# EAGLE design Cap1 (EAGLE 7.7.0)
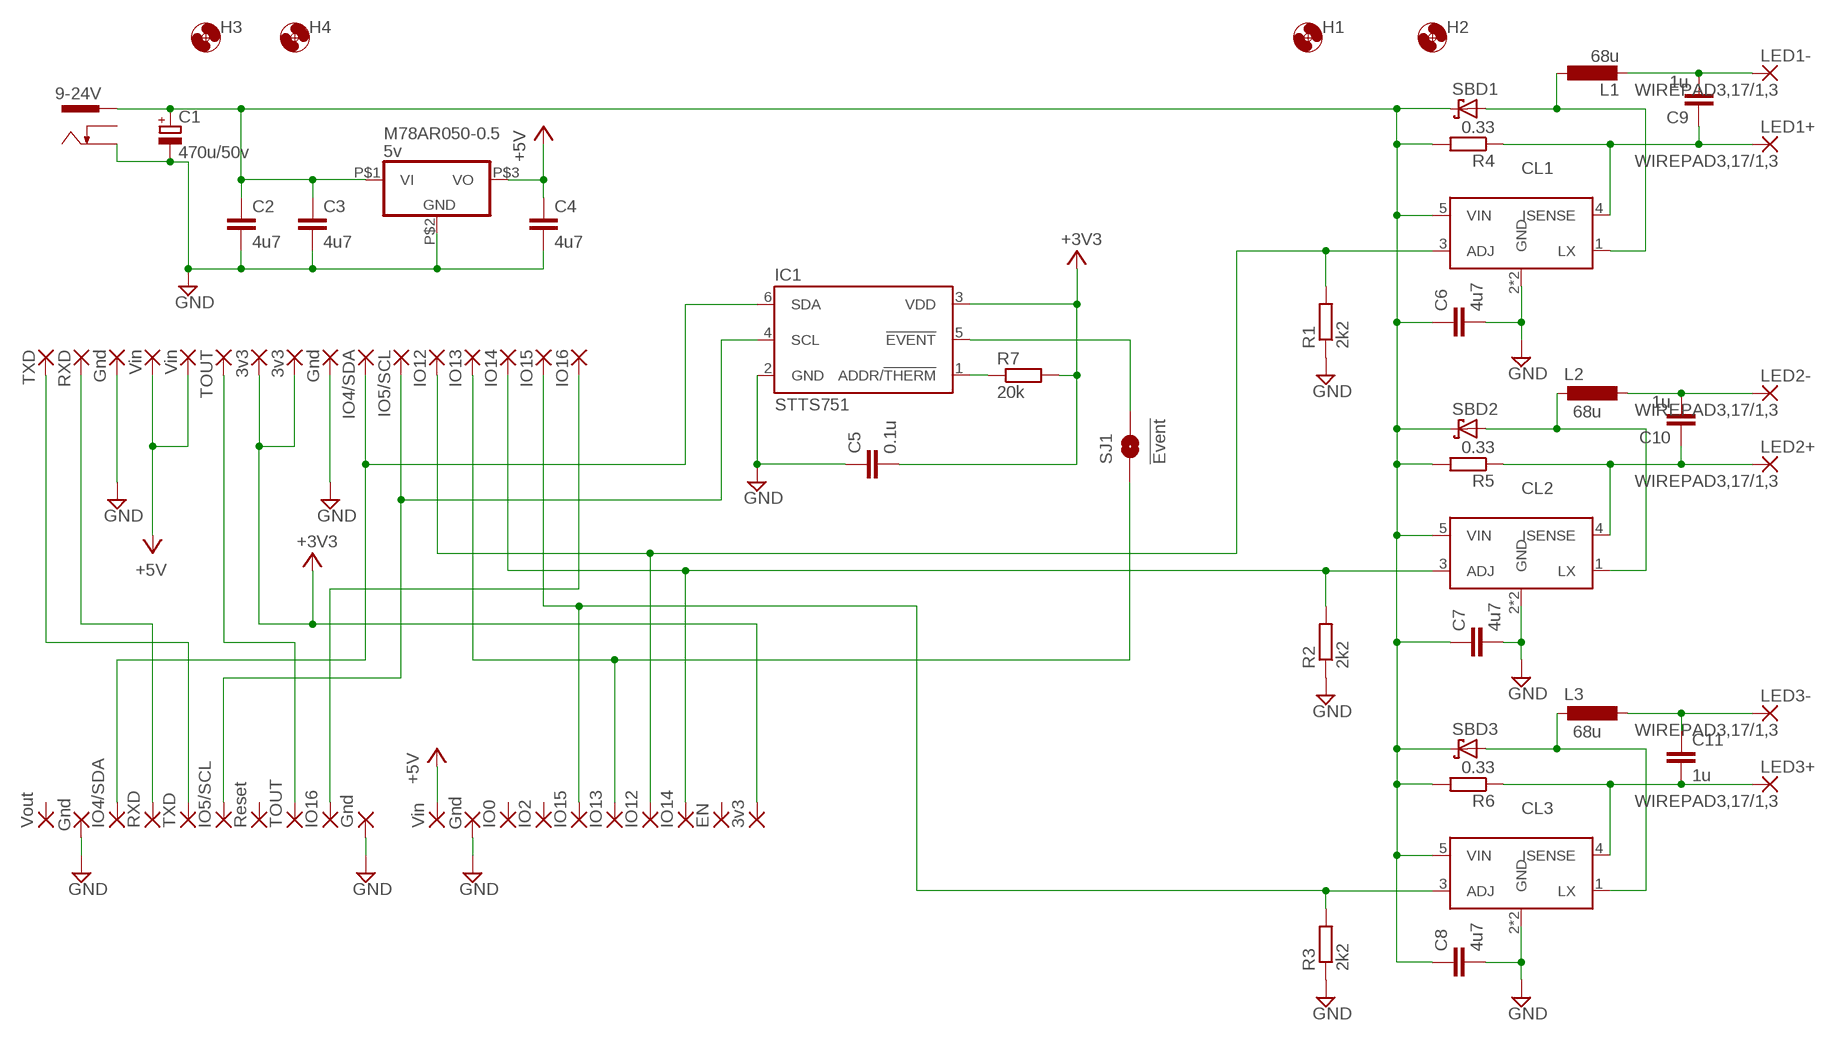
[diagram p0: schematic, sheet 1]

## Parts
0  IO0  1,6/0,8  [1,6/0,8]
2  IO2  1,6/0,8  [1,6/0,8]
3V  3v3  1,6/0,8  [1,6/0,8]
3V3  3v3  1,6/0,8  [1,6/0,8]
3V3'  3v3  1,6/0,8  [1,6/0,8]
4  IO4/SDA  1,6/0,8  [1,6/0,8]
5  IO5/SCL  1,6/0,8  [1,6/0,8]
9-24V  DCJACK-MJ179P-R  [MJ-179P-R]
12  IO12  1,6/0,8  [1,6/0,8]
13  IO13  1,6/0,8  [1,6/0,8]
14  IO14  1,6/0,8  [1,6/0,8]
15  IO15  1,6/0,8  [1,6/0,8]
16  IO16  1,6/0,8  [1,6/0,8]
C1  470u/50v  CPOL-EUE5-13  [E5-13]
C2  4u7  C-EUC0805  [C0805]
C3  4u7  C-EUC0805  [C0805]
C4  4u7  C-EUC0805  [C0805]
C5  0.1u  C-EUC0603  [C0603]
C6  4u7  C-EUC0805  [C0805]
C7  4u7  C-EUC0805  [C0805]
C8  4u7  C-EUC0805  [C0805]
C9  1u  C-EUC0603  [C0603]
C10  1u  C-EUC0603  [C0603]
C11  1u  C-EUC0603  [C0603]
CL1  CL6807  [SOT89-5]
CL2  CL6807  [SOT89-5]
CL3  CL6807  [SOT89-5]
EN  EN  1,6/0,8  [1,6/0,8]
G  Gnd  1,6/0,8  [1,6/0,8]
G'  Gnd  1,6/0,8  [1,6/0,8]
G''  Gnd  1,6/0,8  [1,6/0,8]
GND  Gnd  1,6/0,8  [1,6/0,8]
GND1  Gnd  1,6/0,8  [1,6/0,8]
H1  MOUNT-HOLE3.0  [3,0]
H2  MOUNT-HOLE3.0  [3,0]
H3  MOUNT-HOLE3.0  [3,0]
H4  MOUNT-HOLE3.0  [3,0]
IC1  STTS751  STTS751-SOT-23-6  [SOT23-6]
IO4/SDA  IO4/SDA  1,6/0,8  [1,6/0,8]
IO5/SCL  IO5/SCL  1,6/0,8  [1,6/0,8]
IO12-CH1  IO12  1,6/0,8  [1,6/0,8]
IO13'  IO13  1,6/0,8  [1,6/0,8]
IO14-CH2  IO14  1,6/0,8  [1,6/0,8]
IO15-CH3  IO15  1,6/0,8  [1,6/0,8]
IO16  IO16  1,6/0,8  [1,6/0,8]
L1  68u  NR10050NR10050  [NR10050]
L2  68u  NR10050NR10050  [NR10050]
L3  68u  NR10050NR10050  [NR10050]
LED1+  WIREPAD3,17/1,3  [3,17/1,3]
LED1-  WIREPAD3,17/1,3  [3,17/1,3]
LED2+  WIREPAD3,17/1,3  [3,17/1,3]
LED2-  WIREPAD3,17/1,3  [3,17/1,3]
LED3+  WIREPAD3,17/1,3  [3,17/1,3]
LED3-  WIREPAD3,17/1,3  [3,17/1,3]
M78AR050-0.5  5v  M78AR033033-0.5  [M78AR]
R1  2k2  R-EU_R0603  [R0603]
R2  2k2  R-EU_R0603  [R0603]
R3  2k2  R-EU_R0603  [R0603]
R4  0.33  R-EU_R3225  [R3225]
R5  0.33  R-EU_R3225  [R3225]
R6  0.33  R-EU_R3225  [R3225]
R7  20k  R-EU_R0603  [R0603]
RS  Reset  1,6/0,8  [1,6/0,8]
RX  RXD  1,6/0,8  [1,6/0,8]
RXD  RXD  1,6/0,8  [1,6/0,8]
SBD1  SS2040FL2SS2040FL  [SOD-123FL]
SBD2  SS2040FL2SS2040FL  [SOD-123FL]
SBD3  SS2040FL2SS2040FL  [SOD-123FL]
SJ1  !Event  SOLDERJUMPERNO  [SJ_2S-NO]
TO  TOUT  1,6/0,8  [1,6/0,8]
TOUT  TOUT  1,6/0,8  [1,6/0,8]
TX  TXD  1,6/0,8  [1,6/0,8]
TXD  TXD  1,6/0,8  [1,6/0,8]
VI  Vin  1,6/0,8  [1,6/0,8]
VIN  Vin  1,6/0,8  [1,6/0,8]
VIN'  Vin  1,6/0,8  [1,6/0,8]
VO  Vout  1,6/0,8  [1,6/0,8]

## Nets
24VSUPPLY [Power]: 9-24V.1 C1.+ C2.1 C3.1 C6.1 C7.1 C8.1 CL1.5(VIN) CL2.5(VIN) CL3.5(VIN) M78AR050-0.5.P$1(VI) R4.2 R5.2 R6.2 SBD1.C SBD2.C SBD3.C
+3V3 [Power3v3]: 3V3'.1(P) 3V3.1(P) 3V.1(P) C5.2 IC1.3(VDD) R7.2
+5V [Power5v]: C4.1 M78AR050-0.5.P$3(VO) VI.1(P) VIN'.1(P) VIN.1(P)
GND [GND]: 9-24V.2 C1.- C2.2 C3.2 C4.2 C5.1 C6.2 C7.2 C8.2 CL1.2(GND) CL1.2@TAB(GND) CL2.2(GND) CL2.2@TAB(GND) CL3.2(GND) CL3.2@TAB(GND) G''.1(P) G'.1(P) G.1(P) GND1.1(P) GND.1(P) IC1.2(GND) M78AR050-0.5.P$2(GND) R1.1 R2.1 R3.1
N$1: RX.1(P) RXD.1(P)
N$2: TX.1(P) TXD.1(P)
N$3: TO.1(P) TOUT.1(P)
N$4: 15.1(P) CL3.3(ADJ) IO15-CH3.1(P) R3.2
N$5: IC1.1(ADDR/!THERM) R7.1
N$6: 13.1(P) IO13'.1(P) SJ1.1
N$7: 4.1(P) IC1.6(SDA) IO4/SDA.1(P)
N$8: 5.1(P) IC1.4(SCL) IO5/SCL.1(P)
N$9: IC1.5(!EVENT) SJ1.2
N$10: 12.1(P) CL1.3(ADJ) IO12-CH1.1(P) R1.2
N$11: 14.1(P) CL2.3(ADJ) IO14-CH2.1(P) R2.2
N$12 [LEDOUT]: C11.1 L3.P$2 LED3-.1(P)
N$13 [LEDOUT]: C9.1 CL1.4(ISENSE) LED1+.1(P) R4.1
N$16 [LEDOUT]: CL1.1(LX) L1.P$1 SBD1.A
N$17 [LEDOUT]: C10.2 L2.P$2 LED2-.1(P)
N$34 [LEDOUT]: CL3.1(LX) L3.P$1 SBD3.A
N$35 [LEDOUT]: CL2.1(LX) L2.P$1 SBD2.A
N$44 [LEDOUT]: C10.1 CL2.4(ISENSE) LED2+.1(P) R5.1
N$45 [LEDOUT]: C9.2 L1.P$2 LED1-.1(P)
N$46: 16.1(P) IO16.1(P)
N$47 [LEDOUT]: C11.2 CL3.4(ISENSE) LED3+.1(P) R6.1
Unconnected: 0.1(P) 2.1(P) 9-24V.3 EN.1(P) RS.1(P) VO.1(P)

## Library data of the parts
0 2 3V 3V3 3V3' 4 5 12-16 EN G G' G'' GND GND1 IO4/SDA IO5/SCL IO12-CH1 IO13' IO14-CH2 IO15-CH3 IO16 RS RX RXD TO TOUT TX TXD VI VIN VIN' VO = wirepad:1,6/0,8: THROUGH-HOLE PAD
9-24V = kamiki-dcjack:DCJACK: DC JACK 2.1mmφ - 5.5mmφ DCジャック、基板用。
C1 = resistor:CPOL-EU: POLARIZED CAPACITOR, European symbol
C2-C11 = resistor:C-EU: CAPACITOR, European symbol
CL1-CL3 = akizuki:CL6807
H1-H4 = holes:MOUNT-HOLE: MOUNTING HOLE with drill center marker
IC1 = stts751:STTS751-SOT-23-6: STTS751
L1-L3 = NR100500:NR10050
LED1+ LED1- LED2+ LED2- LED3+ LED3- = wirepad:WIREPAD: Wire PAD connect wire on PCB
M78AR050-0.5 = akizuki:M78AR033: The MINMAX M78A series is a new range of switching regulators designed as a drop-in replacement for old LM78xx linear regulators with low efficiency.
R1-R7 = resistor:R-EU_: RESISTOR, European symbol
SBD1-SBD3 = akizuki:SS2040FL: SS2040FL 2A/40V ULTRA-LOW VF SURFACE MOUNT SCHOTTKY DIODE These ultra-efficient, low VF Schottky diodes feature high current capability, while housed in a very small SOD-123 Flat Lead package. They are ideal for applications requiring maximum power dissipation per board area.
SJ1 = SparkFun:SOLDERJUMPER: Solder Jumper Standard SMD solder jumper. Used to automate production. Two varients : Normally Open and Normally Closed are the same, but have different paste layers. NC will have a large amount of paste and should jumper during reflow.

## Net classes
1 Power: width 1.016 mm
3 Power5v: width 0.61 mm
4 Power3v3: width 0.305 mm
5 LEDOUT: width 0.61 mm, clearance 0.305 mm
6 GND: width 1.016 mm
7 newNet: width 0.61 mm

## Board
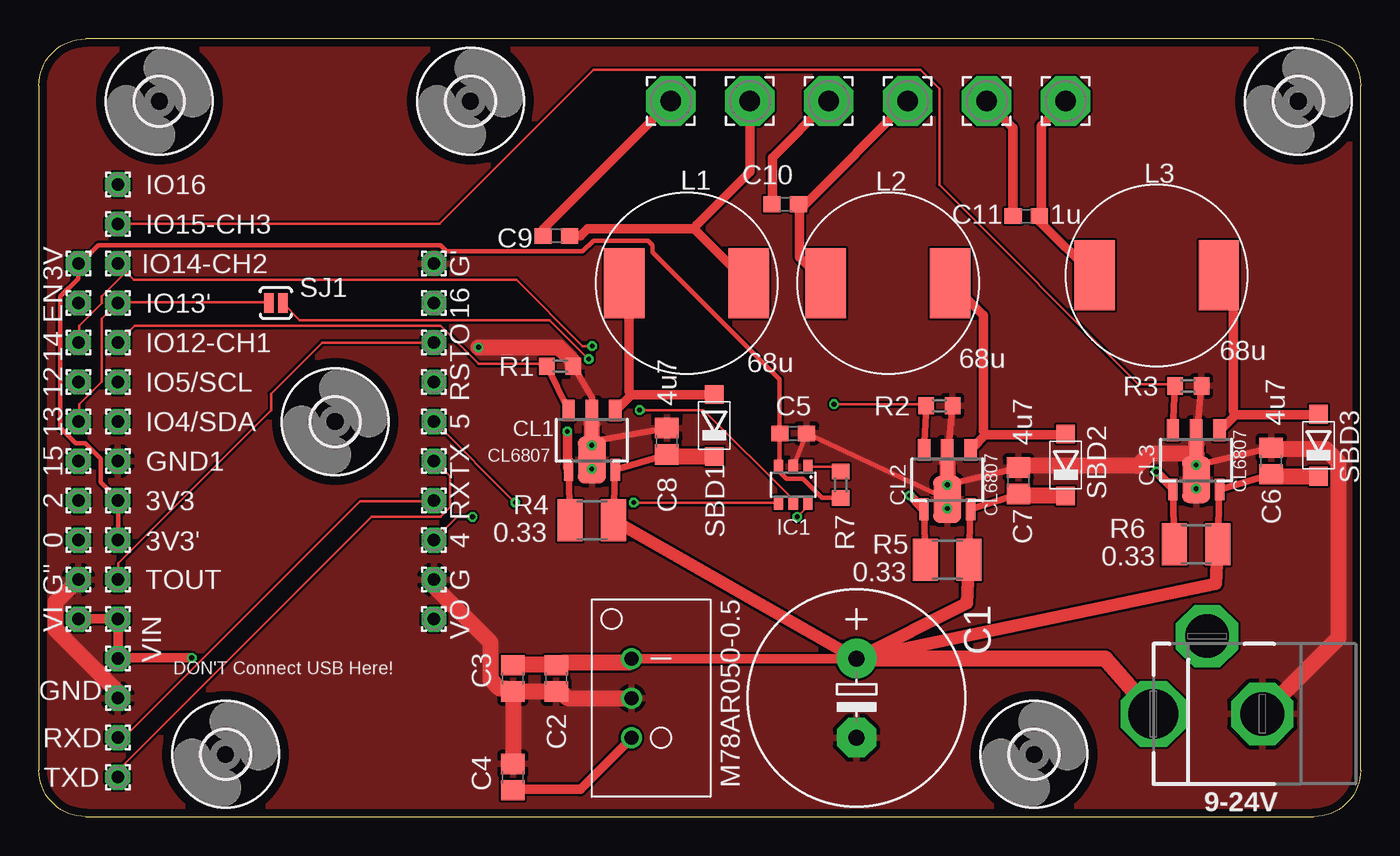
[diagram p1: board, top side]
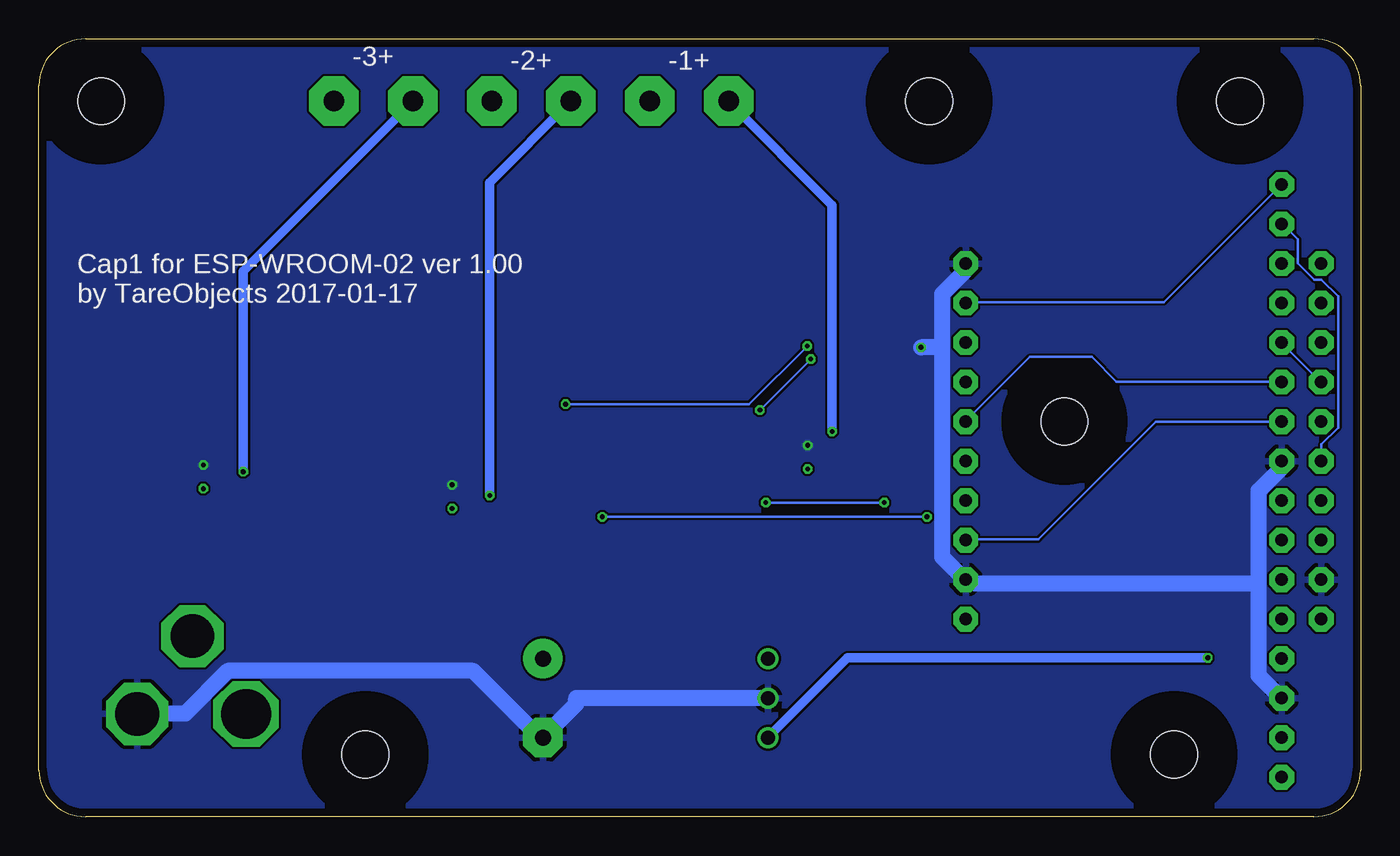
[diagram p2: board, bottom side, seen from below]

Size 85 x 50 mm. Coordinates in mm from the lower left corner, seen from the top.
Outline: 3,0 82,0 arc90 85,3 85,47 arc90 82,50 3,50 arc90 0,47 0,3 arc90 3,0
Copper layers (1*16): Top 0.035mm / dielectric 1.6mm / Bottom 0.035mm
Design rules "Elecrow_2-layer_PCB_eagle_rule": minimum track width 6mil, minimum drill 12mil, track to track 6mil, track to pad 6mil, pad to pad 6mil, via to via 8mil, smd to smd 0mil, copper to edge 20mil, drill to drill 10mil, minimum pad ring 6mil, minimum via ring 6mil, stop-mask expansion 0mil, vias tented up to drill 100mil, thermal gap 10mil

### Footprints (pad centres in the part's own frame; a part is rotated, then mirrored left to right if it is on the bottom)
1,6/0,8 = drill 0.813 pad 1.6 octagon: 1 0,0
MJ-179P-R = drill 3.2 pad 4 octagon: 1 3,0 | drill 2.8 pad 4 octagon: 2 -4,0; 3 -0.45,-5
E5-13 = drill 1.016 pad 2.54: + -2.54,0 | drill 1.016 pad 2.54 octagon: - 2.54,0
C0805 = smd 1.3 x 1.5: 1 -0.85,0; 2 0.85,0
C0603 = smd 1.1 x 1: 1 -0.85,0; 2 0.85,0
SOT89-5 = smd 0.8 x 1.4: 1 -1.499,-1.981; 3 1.499,-1.981 | smd 0.8 x 2.9: 2 0,-1.227 | smd 1.8 x 3: 2@TAB 0,1.2 | smd 0.6 x 1.4: 4 1.499,1.829; 5 -1.499,1.829
3,0 = hole 3: 0,0
SOT23-6 = smd 0.6 x 0.9: 1 -0.95,-1.15; 2 0,-1.15; 3 0.95,-1.15; 4 0.95,1.15; 5 0,1.15; 6 -0.95,1.15
NR10050 = smd 2.6 x 4.5: P$1 -4,0; P$2 4,0
3,17/1,3 = drill 1.321 pad 3.175 octagon: 1 0,0
M78AR = drill 0.9: P$1 -2.54,0; P$2 0,0; P$3 2.54,0
R0603 = smd 1 x 1.1: 1 -0.85,0; 2 0.85,0
R3225 = smd 1.6 x 2.7: 1 -1.4,0; 2 1.4,0
SOD-123FL = smd 1.194 x 1.194: A 1.994,0; C -1.994,0
SJ_2S-NO = smd 0.635 x 1.27: 1 -0.45,0; 2 0.45,0

### Placement (x,y rotation side)
0  2.54,17.78 90 top
2  2.54,20.32 90 top
3V  2.54,35.56 90 top
3V3  5.08,20.32 90 top
3V3'  5.08,17.78 90 top
4  25.4,17.78 90 top
5  25.4,25.4 90 top
9-24V  74.68,6.6 180 top
12  2.54,27.94 90 top
13  2.54,25.4 90 top
14  2.54,30.48 90 top
15  2.54,22.86 90 top
16  25.4,33.02 90 top
C1  52.58,7.62 270 top
C2  33.27,8.89 270 top
C3  30.48,8.89 270 top
C4  30.48,2.54 90 top
C5  48.51,24.64 180 top
C6  79.25,22.86 90 top
C7  62.99,21.59 90 top
C8  40.39,24.13 90 top
C9  33.27,37.34 0 top
C10  48.01,39.37 0 top
C11  63.5,38.61 180 top
CL1  35.56,24.13 180 top
CL2  58.42,21.59 180 top
CL3  74.42,22.86 180 top
EN  2.54,33.02 90 top
G  25.4,15.24 90 top
G'  25.4,35.56 90 top
G''  2.54,15.24 90 top
GND  5.08,7.62 90 top
GND1  5.08,22.86 90 top
H1  7.75,46 0 top
H2  64,4 0 top
H3  27.75,46 0 top
H4  81,46 0 top
H5  MOUNT-HOLE3.0  [3,0]  19.05,25.4 0 top
H6  MOUNT-HOLE3.0  [3,0]  12,4 0 top
IC1  48.51,21.34 180 top
IO4/SDA  5.08,25.4 90 top
IO5/SCL  5.08,27.94 90 top
IO12-CH1  5.08,30.48 90 top
IO13'  5.08,33.02 90 top
IO14-CH2  5.08,35.56 90 top
IO15-CH3  5.08,38.1 90 top
IO16  5.08,40.64 90 top
L1  41.66,34.29 0 top
L2  54.61,34.29 180 top
L3  71.88,34.8 180 top
LED1+  40.64,46 0 top
LED1-  45.72,46 180 top
LED2+  50.8,46 0 top
LED2-  55.88,46 0 top
LED3+  60.96,46 0 top
LED3-  66.04,46 0 top
M78AR050-0.5  38.1,7.62 270 top
R1  33.53,28.96 180 top
R2  57.91,26.42 180 top
R3  73.91,27.69 180 top
R4  35.56,19.05 0 top
R5  58.42,16.51 0 top
R6  74.42,17.53 0 top
R7  51.56,21.34 270 top
RS  25.4,27.94 90 top
RX  25.4,20.32 90 top
RXD  5.08,5.08 90 top
SBD1  43.43,25.15 90 top
SBD2  66.04,22.61 90 top
SBD3  82.3,23.88 90 top
SJ1  15.24,33.02 0 top
TO  25.4,30.48 90 top
TOUT  5.08,15.24 90 top
TX  25.4,22.86 90 top
TXD  5.08,2.54 90 top
VI  2.54,12.7 90 top
VIN  5.08,10.16 90 top
VIN'  5.08,12.7 90 top
VO  25.4,12.7 90 top

### Tracks (layer width: path | path; a pad name or v marks a point on that pad's centre or on a via)
24VSUPPLY
  Top 0.406: R4.2 CL1.5 C8.1 | R5.2 CL2.5 C7.1 | R6.2 CL3.5 C6.1
  Top 0.61: M78AR050-0.5.P$1 C1.+
  Top 0.813: C1.+ R4.2 | C1.+ 59.69,13.72 R5.2 | R6.2 75.69,14.99 C1.+
  Top 1.016: 9-24V.1 68.58,10.16 C1.+ | C3.1 30.48,9.75 33.22,9.75 C2.1 33.76,9.91 37.95,9.91 M78AR050-0.5.P$1 | SBD2.C 65.99,20.65 63.17,20.65 C7.1 | SBD3.C 79.4,21.87 C6.1 | SBD1.C 43.43,23.16 40.54,23.16 C8.1
+3V3
  Top 0.305: C5.2 47.62,24.61 47.62,22.55 IC1.3 47.62,22.4 47.62,22.17 48.08,21.72 49.15,21.72 50.37,20.5 51.51,20.5 R7.2 | 3V3'.1 5.11,17.83 5.11,20.27 3V3.1 5.03,20.42 3.96,21.49 3.96,23.01 2.97,24 2.36,24 1.37,24.99 1.37,33.45 2.52,34.59 2.52,35.51 3V.1 2.67,35.59 3.81,36.73 25.83,36.73 26.21,36.35 34.98,36.35 35.66,37.03 39.17,37.03 39.47,36.73 39.47,36.27 47.62,28.12 47.62,24.92 C5.2 | 47.62,24.77 C5.2
+5V  (via drill 0.3)
  Top 0.61: VI.1 2.59,12.72 4.8,12.72 VIN'.1 5.11,12.65 5.11,10.21 VIN.1 5.41,10.21 v9.83,10.21 | C4.1 30.48,1.75 34.82,1.75 38.1,5.03 M78AR050-0.5.P$3
  Bottom 0.61: v9.83,10.21 32.99,10.21 38.1,5.11 M78AR050-0.5.P$3
GND  (via drill 0.3)
  Top 0.305: IC1.2 C5.1 CL2.2@TAB
  Top 0.406: CL2.2 R2.1 | CL3.2 R3.1 | C8.2 35.56,24.13 v35.56,23.88 CL1.2@TAB | C7.2 v58.42,21.34 CL2.2@TAB | R1.1 35.56,26.92 CL1.2 | C6.2 v74.42,22.61 CL3.2@TAB
  Top 1.016: 74.45,23.32 74.45,22.78 CL3.2@TAB | 74.45,23.32 74.45,23.93 CL3.2 | C6.2 79.4,23.62 82.75,23.62 83.59,22.78 83.59,11.51 78.72,6.63 9-24V.2 | GND.1 5.03,7.62 5.03,8.08 1.07,12.04 1.07,13.79 2.52,15.24 G''.1 | CL1.2 35.59,25.22 35.59,24.31 CL1.2@TAB | C3.2 C4.2 | C3.2 30.94,8.08 33.22,8.08 C2.2 33.76,7.85 33.98,7.62 M78AR050-0.5.P$2 | G.1 25.45,15.24 25.45,14.78 29.03,11.2 29.03,8.84 29.64,8.23 30.02,8.23 C3.2 | v28.27,30.18 33.45,30.18 34.29,29.34 34.29,29.11 R1.1 | CL2.2 58.45,22.63 58.45,21.49 CL2.2@TAB | 74.45,23.32 71.4,23.32 70.64,22.55 63.17,22.55 C7.2
  Bottom 1.016: 6.55,15.01 6.55,9.07 5.11,7.62 GND.1 | 6.55,15.01 6.55,20.95 5.11,22.4 5.11,22.86 GND1.1 | 26.9,30.18 26.9,16.69 25.45,15.24 G.1 24.92,15.01 6.55,15.01 | 26.9,30.18 26.9,33.6 25.45,35.05 25.45,35.51 G'.1 | 26.9,30.18 v28.27,30.18 | M78AR050-0.5.P$2 50.44,7.62 50.44,7.24 52.58,5.11 C1.- 53.03,5.33 57.07,9.37 72.85,9.37 75.59,6.63 78.64,6.63 9-24V.2
  pour Bottom: 0,0 86.36,0 86.36,50.8 0,50.8
  pour Top: 0,0 88.9,0 88.9,50.8 0,50.8
N$1
  Top 0.152: RXD.1 5.11,5.11 5.49,5.11 20.65,20.27 25.38,20.27 RX.1
N$2
  Top 0.152: TXD.1 5.11,2.59 5.11,2.97 21.41,19.28 25.83,19.28 26.44,19.89 26.44,21.87 25.45,22.86 TX.1
N$3
  Top 0.152: TO.1 18.21,30.48 14.94,27.2 14.94,26.14 5.11,16.31 5.11,15.24 TOUT.1
N$4
  Top 0.152: IO15-CH3.1 25.76,38.1 35.66,48.01 56.69,48.01 57.91,46.79 57.91,40.62 70.71,27.81 72.92,27.81 R3.2
  Top 0.406: CL3.3 R3.2
  Bottom 0.152: 15.1 2.52,22.86 2.52,23.93 1.45,24.99 1.45,33.45 2.52,34.52 2.97,34.52 4.04,35.59 4.04,37.11 5.03,38.1 IO15-CH3.1
N$5
  Top 0.152: IC1.1 49.53,22.48 51.28,22.48 51.51,22.25 R7.1
N$6
  Top 0.152: SJ1.1 14.78,33.07 5.11,33.07 IO13'.1 5.03,32.99 4.04,32 4.04,27.96 2.59,26.52 2.59,25.45 13.1
N$7  (via drill 0.3)
  Top 0.152: v48.77,19.28 49.45,19.96 49.45,20.12 IC1.6 | v27.89,19.28 26.9,19.28 4.1
  Bottom 0.152: v27.89,19.28 v48.77,19.28 | IO4/SDA.1 5.11,25.38 13.18,25.38 20.73,17.83 25.38,17.83 4.1
N$8  (via drill 0.3)
  Top 0.152: v38.25,20.19 47.55,20.19 IC1.4 | v30.63,20.19 25.45,25.38 5.1
  Bottom 0.152: v30.63,20.19 v38.25,20.19 | IO5/SCL.1 5.11,27.96 15.7,27.96 17.3,29.57 21.26,29.57 25.38,25.45 5.1
N$9  (via drill 0.3)
  Top 0.152: v38.63,26.14 42.75,26.14 48.46,20.42 48.46,20.19 IC1.5 | v35.36,29.41 32.84,31.93 16.76,31.93 15.7,32.99 SJ1.2
  Bottom 0.152: v35.36,29.41 v38.63,26.14
N$10
  Top 0.152: R1.2 32.54,29.11 28.27,29.11 25.83,31.55 6.17,31.55 5.11,30.48 IO12-CH1.1
  Top 0.406: CL1.3 R1.2
  Bottom 0.152: 12.1 2.59,27.96 5.11,30.48 IO12-CH1.1
N$11  (via drill 0.3)
  Top 0.152: v51.13,26.52 56.92,26.52 R2.2 | v35.59,30.25 34.98,30.25 30.71,34.52 6.1,34.52 5.11,35.51 IO14-CH2.1 5.56,34.98 4.04,33.45 4.04,32.99 2.59,31.55 2.59,30.48 14.1
  Top 0.406: CL2.3 R2.2
  Bottom 0.152: v51.13,26.52 39.32,26.52 v35.59,30.25
N$12
  Top 0.61: L3.P$2 67.82,34.82 64.39,38.25 64.39,38.56 C11.1 64.47,38.86 64.47,44.42 65.99,45.95 LED3-.1
N$13  (via drill 0.3)
  Top 0.406: R4.1 CL1.4
  Top 0.61: C9.1 32.46,37.34 32.46,37.8 40.62,45.95 LED1+.1 | v33.98,24.77 33.98,22.48 CL1.4
  Bottom 0.61: v33.98,24.77 33.98,39.32 40.62,45.95 LED1+.1
N$14  (via drill 0.3)
  other vias: 35.56,22.35
N$15  (via drill 0.3)
  other vias: 58.42,19.81
N$16
  Top 0.61: 38.1,27.13 43.43,27.13 SBD1.A | 38.1,27.13 37.11,26.14 CL1.1 | 38.1,27.13 37.95,27.36 37.95,34.06 37.72,34.29 L1.P$1
N$17
  Top 0.61: L2.P$2 50.6,34.29 48.92,35.97 48.92,39.32 C10.2 49.23,39.32 55.85,45.95 LED2-.1
N$18  (via drill 0.3)
  other vias: 74.42,21.08
N$34
  Top 0.61: 76.96,25.83 82.3,25.83 SBD3.A | 76.96,25.83 75.97,24.84 CL3.1 | 76.96,25.83 76.81,26.06 76.81,33.83 75.89,34.75 L3.P$1
N$35
  Top 0.61: 60.88,24.54 65.99,24.54 SBD2.A | 60.88,24.54 59.97,23.62 CL2.1 | 60.88,24.54 60.73,24.77 60.73,32.23 58.67,34.29 L2.P$1
N$44  (via drill 0.3)
  Top 0.406: R5.1 CL2.4
  Top 0.61: C10.1 47.17,39.4 47.17,42.37 50.75,45.95 LED2+.1 | v56.01,20.65 56.77,19.89 CL2.4
  Bottom 0.61: v56.01,20.65 56.01,40.77 50.83,45.95 LED2+.1
N$45
  Top 0.61: C9.2 34.82,37.34 35.28,37.8 42.14,37.8 | 42.14,37.8 45.64,34.29 L1.P$2 | LED1-.1 45.72,41.45 42.29,38.02 42.14,37.8
N$46
  Bottom 0.152: IO16.1 12.65,33.07 25.38,33.07 16.1
N$47  (via drill 0.3)
  Top 0.406: R6.1 CL3.4
  Top 0.61: C11.2 62.64,38.63 62.64,44.27 60.96,45.95 LED3+.1 | v71.86,22.17 72.85,21.18 CL3.4
  Bottom 0.61: v71.86,22.17 71.86,35.05 60.96,45.95 LED3+.1

### Text on the board
tNames: DON'T Connect USB Here!
bNames: -1+ | -2+ | -3+ | Cap1 for ESP-WROOM-02 ver 1.00 / by TareObjects 2017-01-17